# Altium schematic sheet Encoders.SchDoc
size Letter
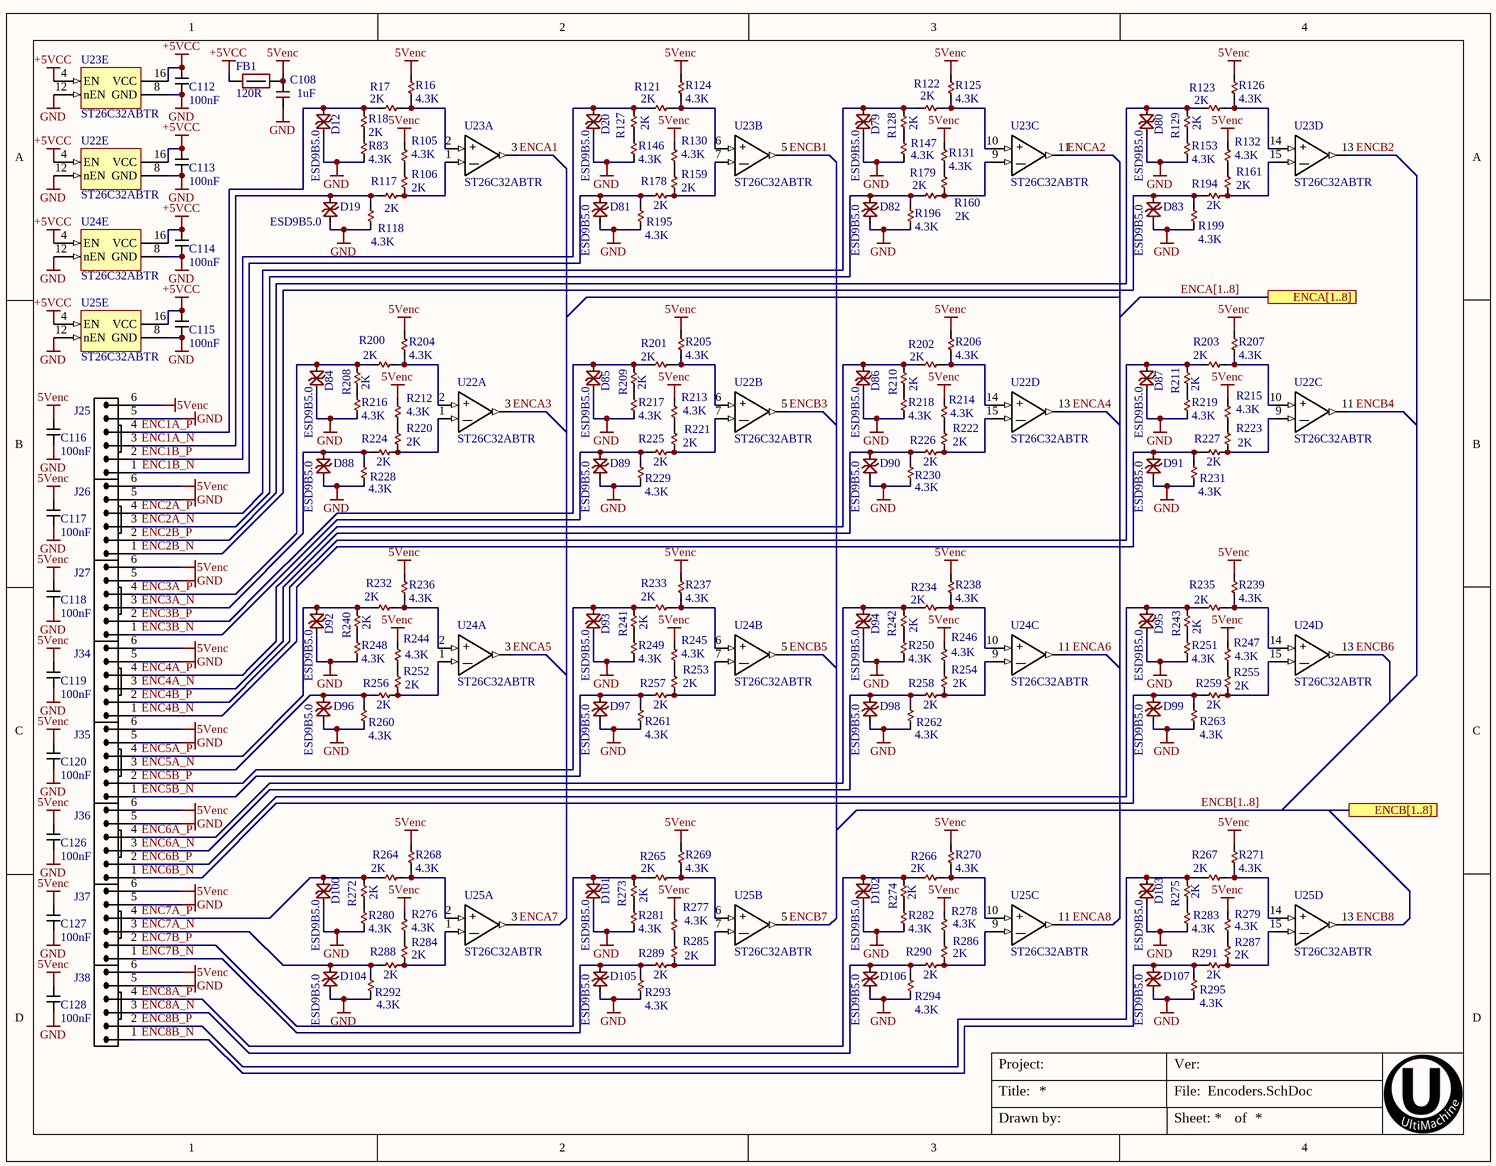
[diagram p0: Encoders.SchDoc]

## Parts
C108  1uF  [C0402]
C112  100nF  [C0201 Large Pads]
C113  100nF  [C0201 Large Pads]
C114  100nF  [C0201 Large Pads]
C115  100nF  [C0201 Large Pads]
C116  100nF  [C0201 Large Pads]
C117  100nF  [C0201 Large Pads]
C118  100nF  [C0201 Large Pads]
C119  100nF  [C0201 Large Pads]
C120  100nF  [C0201 Large Pads]
C126  100nF  [C0201 Large Pads]
C127  100nF  [C0201 Large Pads]
C128  100nF  [C0201 Large Pads]
D12  ESD9B5.0  [SOD923-D]
D19  ESD9B5.0  [SOD923-D]
D20  ESD9B5.0  [SOD923-D]
D79  ESD9B5.0  [SOD923-D]
D80  ESD9B5.0  [SOD923-D]
D81  ESD9B5.0  [SOD923-D]
D82  ESD9B5.0  [SOD923-D]
D83  ESD9B5.0  [SOD923-D]
D84  ESD9B5.0  [SOD923-D]
D85  ESD9B5.0  [SOD923-D]
D86  ESD9B5.0  [SOD923-D]
D87  ESD9B5.0  [SOD923-D]
D88  ESD9B5.0  [SOD923-D]
D89  ESD9B5.0  [SOD923-D]
D90  ESD9B5.0  [SOD923-D]
D91  ESD9B5.0  [SOD923-D]
D92  ESD9B5.0  [SOD923-D]
D93  ESD9B5.0  [SOD923-D]
D94  ESD9B5.0  [SOD923-D]
D95  ESD9B5.0  [SOD923-D]
D96  ESD9B5.0  [SOD923-D]
D97  ESD9B5.0  [SOD923-D]
D98  ESD9B5.0  [SOD923-D]
D99  ESD9B5.0  [SOD923-D]
D100  ESD9B5.0  [SOD923-D]
D101  ESD9B5.0  [SOD923-D]
D102  ESD9B5.0  [SOD923-D]
D103  ESD9B5.0  [SOD923-D]
D104  ESD9B5.0  [SOD923-D]
D105  ESD9B5.0  [SOD923-D]
D106  ESD9B5.0  [SOD923-D]
D107  ESD9B5.0  [SOD923-D]
FB1  120R  [FB0603]
J25  Molex 70543-05  [70543-05_PIN-IN-PASTE]  (value not drawn)
J26  Molex 70543-05  [70543-05_PIN-IN-PASTE]  (value not drawn)
J27  Molex 70543-05  [70543-05_PIN-IN-PASTE]  (value not drawn)
J34  Molex 70543-05  [70543-05_PIN-IN-PASTE]  (value not drawn)
J35  Molex 70543-05  [70543-05_PIN-IN-PASTE]  (value not drawn)
J36  Molex 70543-05  [70543-05_PIN-IN-PASTE]  (value not drawn)
J37  Molex 70543-05  [70543-05_PIN-IN-PASTE]  (value not drawn)
J38  Molex 70543-05  [70543-05_PIN-IN-PASTE]  (value not drawn)
R16  4.3K  [R0402]
R17  2K  [R0402]
R18  2K  [R0402]
R83  4.3K  [R0402]
R105  4.3K  [R0402]
R106  2K  [R0402]
R117  2K  [R0402]
R118  4.3K  [R0402]
R121  2K  [R0402]
R122  2K  [R0402]
R123  2K  [R0402]
R124  4.3K  [R0402]
R125  4.3K  [R0402]
R126  4.3K  [R0402]
R127  2K  [R0402]
R128  2K  [R0402]
R129  2K  [R0402]
R130  4.3K  [R0402]
R131  4.3K  [R0402]
R132  4.3K  [R0402]
R146  4.3K  [R0402]
R147  4.3K  [R0402]
R153  4.3K  [R0402]
R159  2K  [R0402]
R160  2K  [R0402]
R161  2K  [R0402]
R178  2K  [R0402]
R179  2K  [R0402]
R194  2K  [R0402]
R195  4.3K  [R0402]
R196  4.3K  [R0402]
R199  4.3K  [R0402]
R200  2K  [R0402]
R201  2K  [R0402]
R202  2K  [R0402]
R203  2K  [R0402]
R204  4.3K  [R0402]
R205  4.3K  [R0402]
R206  4.3K  [R0402]
R207  4.3K  [R0402]
R208  2K  [R0402]
R209  2K  [R0402]
R210  2K  [R0402]
R211  2K  [R0402]
R212  4.3K  [R0402]
R213  4.3K  [R0402]
R214  4.3K  [R0402]
R215  4.3K  [R0402]
R216  4.3K  [R0402]
R217  4.3K  [R0402]
R218  4.3K  [R0402]
R219  4.3K  [R0402]
R220  2K  [R0402]
R221  2K  [R0402]
R222  2K  [R0402]
R223  2K  [R0402]
R224  2K  [R0402]
R225  2K  [R0402]
R226  2K  [R0402]
R227  2K  [R0402]
R228  4.3K  [R0402]
R229  4.3K  [R0402]
R230  4.3K  [R0402]
R231  4.3K  [R0402]
R232  2K  [R0402]
R233  2K  [R0402]
R234  2K  [R0402]
R235  2K  [R0402]
R236  4.3K  [R0402]
R237  4.3K  [R0402]
R238  4.3K  [R0402]
R239  4.3K  [R0402]
R240  2K  [R0402]
R241  2K  [R0402]
R242  2K  [R0402]
R243  2K  [R0402]
R244  4.3K  [R0402]
R245  4.3K  [R0402]
R246  4.3K  [R0402]
R247  4.3K  [R0402]
R248  4.3K  [R0402]
R249  4.3K  [R0402]
R250  4.3K  [R0402]
R251  4.3K  [R0402]
R252  2K  [R0402]
R253  2K  [R0402]
R254  2K  [R0402]
R255  2K  [R0402]
R256  2K  [R0402]
R257  2K  [R0402]
R258  2K  [R0402]
R259  2K  [R0402]
R260  4.3K  [R0402]
R261  4.3K  [R0402]
R262  4.3K  [R0402]
R263  4.3K  [R0402]
R264  2K  [R0402]
R265  2K  [R0402]
R266  2K  [R0402]
R267  2K  [R0402]
R268  4.3K  [R0402]
R269  4.3K  [R0402]
R270  4.3K  [R0402]
R271  4.3K  [R0402]
R272  2K  [R0402]
R273  2K  [R0402]
R274  2K  [R0402]
R275  2K  [R0402]
R276  4.3K  [R0402]
R277  4.3K  [R0402]
R278  4.3K  [R0402]
R279  4.3K  [R0402]
R280  4.3K  [R0402]
R281  4.3K  [R0402]
R282  4.3K  [R0402]
R283  4.3K  [R0402]
R284  2K  [R0402]
R285  2K  [R0402]
R286  2K  [R0402]
R287  2K  [R0402]
R288  2K  [R0402]
R289  2K  [R0402]
R290  2K  [R0402]
R291  2K  [R0402]
R292  4.3K  [R0402]
R293  4.3K  [R0402]
R294  4.3K  [R0402]
R295  4.3K  [R0402]
U22  ST26C32ABTR  [TSSOP16-65P640X120-16N]  (parts A,B,C,D,E of 5)
U23  ST26C32ABTR  [TSSOP16-65P640X120-16N]  (parts A,B,C,D,E of 5)
U24  ST26C32ABTR  [TSSOP16-65P640X120-16N]  (parts A,B,C,D,E of 5)
U25  ST26C32ABTR  [TSSOP16-65P640X120-16N]  (parts A,B,C,D,E of 5)

## Ports
ENCA[1..8], ENCB[1..8]

## Nets
5Venc: C108.2 C116.2 C117.2 C118.2 C119.2 C120.2 C126.2 C127.2 C128.2 FB1.2 J25.6 J26.6 J27.6 J34.6 J35.6 J36.6 J37.6 J38.6 R16.2 R105.2 R124.2 R125.2 R126.2 R130.2 R131.2 R132.2 R204.2 R205.2 R206.2 R207.2 R212.2 R213.2 R214.2 R215.2 R236.2 R237.2 R238.2 R239.2 R244.2 R245.2 R246.2 R247.2 R268.2 R269.2 R270.2 R271.2 R276.2 R277.2 R278.2 R279.2
+5VCC: C112.2 C113.2 C114.2 C115.2 FB1.1 U22.4(EN) U22.16(VCC) U23.4(EN) U23.16(VCC) U24.4(EN) U24.16(VCC) U25.4(EN) U25.16(VCC)
GND: C108.1 C112.1 C113.1 C114.1 C115.1 C116.1 C117.1 C118.1 C119.1 C120.1 C126.1 C127.1 C128.1 D12.K D19.K D20.K D79.K D80.K D81.K D82.K D83.K D84.K D85.K D86.K D87.K D88.K D89.K D90.K D91.K D92.K D93.K D94.K D95.K D96.K D97.K D98.K D99.K D100.K D101.K D102.K D103.K D104.K D105.K D106.K D107.K J25.5 J26.5 J27.5 J34.5 J35.5 J36.5 J37.5 J38.5 R83.1 R118.1 R146.1 R147.1 R153.1 R195.1 R196.1 R199.1 R216.1 R217.1 R218.1 R219.1 R228.1 R229.1 R230.1 R231.1 R248.1 R249.1 R250.1 R251.1 R260.1 R261.1 R262.1 R263.1 R280.1 R281.1 R282.1 R283.1 R292.1 R293.1 R294.1 R295.1 U22.8(GND) U22.12(nEN) U23.8(GND) U23.12(nEN) U24.8(GND) U24.12(nEN) U25.8(GND) U25.12(nEN)
ENC1A_N: D19.A J25.3 R117.2 R118.2
ENC1A_P: D12.A J25.4 R17.1 R18.2
ENC1B_N: D81.A J25.1 R178.2 R195.2
ENC1B_P: D20.A J25.2 R121.1 R127.2
ENC2A_N: D82.A J26.3 R179.2 R196.2
ENC2A_P: D79.A J26.4 R122.1 R128.2
ENC2B_N: D83.A J26.1 R194.2 R199.2
ENC2B_P: D80.A J26.2 R123.1 R129.2
ENC3A_N: D88.A J27.3 R224.2 R228.2
ENC3A_P: D84.A J27.4 R200.1 R208.2
ENC3B_N: D89.A J27.1 R225.2 R229.2
ENC3B_P: D85.A J27.2 R201.1 R209.2
ENC4A_N: D90.A J34.3 R226.2 R230.2
ENC4A_P: D86.A J34.4 R202.1 R210.2
ENC4B_N: D91.A J34.1 R227.2 R231.2
ENC4B_P: D87.A J34.2 R203.1 R211.2
ENC5A_N: D96.A J35.3 R256.2 R260.2
ENC5A_P: D92.A J35.4 R232.1 R240.2
ENC5B_N: D97.A J35.1 R257.2 R261.2
ENC5B_P: D93.A J35.2 R233.1 R241.2
ENC6A_N: D98.A J36.3 R258.2 R262.2
ENC6A_P: D94.A J36.4 R234.1 R242.2
ENC6B_N: D99.A J36.1 R259.2 R263.2
ENC6B_P: D95.A J36.2 R235.1 R243.2
ENC7A_N: D104.A J37.3 R288.2 R292.2
ENC7A_P: D100.A J37.4 R264.1 R272.2
ENC7B_N: D105.A J37.1 R289.2 R293.2
ENC7B_P: D101.A J37.2 R265.1 R273.2
ENC8A_N: D106.A J38.3 R290.2 R294.2
ENC8A_P: D102.A J38.4 R266.1 R274.2
ENC8B_N: D107.A J38.1 R291.2 R295.2
ENC8B_P: D103.A J38.2 R267.1 R275.2
ENCA1: U23.3(OUT)
ENCA2: U23.11(OUT)
ENCA3: U22.3(OUT)
ENCA4: U22.13(OUT)
ENCA5: U24.3(OUT)
ENCA6: U24.11(OUT)
ENCA7: U25.3(OUT)
ENCA8: U25.11(OUT)
ENCB1: U23.5(OUT)
ENCB2: U23.13(OUT)
ENCB3: U22.5(OUT)
ENCB4: U22.11(OUT)
ENCB5: U24.5(OUT)
ENCB6: U24.13(OUT)
ENCB7: U25.5(OUT)
ENCB8: U25.13(OUT)
NetR16_1: R16.1 R17.2 U23.2(IN+)
NetR18_1: R18.1 R83.2
NetR105_1: R105.1 R106.2
NetR106_1: R106.1 R117.1 U23.1(IN-)
NetR121_2: R121.2 R124.1 U23.6(IN+)
NetR122_2: R122.2 R125.1 U23.10(IN+)
NetR123_2: R123.2 R126.1 U23.14(IN+)
NetR127_1: R127.1 R146.2
NetR128_1: R128.1 R147.2
NetR129_1: R129.1 R153.2
NetR130_1: R130.1 R159.2
NetR131_1: R131.1 R160.2
NetR132_1: R132.1 R161.2
NetR159_1: R159.1 R178.1 U23.7(IN-)
NetR160_1: R160.1 R179.1 U23.9(IN-)
NetR161_1: R161.1 R194.1 U23.15(IN-)
NetR200_2: R200.2 R204.1 U22.2(IN+)
NetR201_2: R201.2 R205.1 U22.6(IN+)
NetR202_2: R202.2 R206.1 U22.14(IN+)
NetR203_2: R203.2 R207.1 U22.10(IN+)
NetR208_1: R208.1 R216.2
NetR209_1: R209.1 R217.2
NetR210_1: R210.1 R218.2
NetR211_1: R211.1 R219.2
NetR212_1: R212.1 R220.2
NetR213_1: R213.1 R221.2
NetR214_1: R214.1 R222.2
NetR215_1: R215.1 R223.2
NetR220_1: R220.1 R224.1 U22.1(IN-)
NetR221_1: R221.1 R225.1 U22.7(IN-)
NetR222_1: R222.1 R226.1 U22.15(IN-)
NetR223_1: R223.1 R227.1 U22.9(IN-)
NetR232_2: R232.2 R236.1 U24.2(IN+)
NetR233_2: R233.2 R237.1 U24.6(IN+)
NetR234_2: R234.2 R238.1 U24.10(IN+)
NetR235_2: R235.2 R239.1 U24.14(IN+)
NetR240_1: R240.1 R248.2
NetR241_1: R241.1 R249.2
NetR242_1: R242.1 R250.2
NetR243_1: R243.1 R251.2
NetR244_1: R244.1 R252.2
NetR245_1: R245.1 R253.2
NetR246_1: R246.1 R254.2
NetR247_1: R247.1 R255.2
NetR252_1: R252.1 R256.1 U24.1(IN-)
NetR253_1: R253.1 R257.1 U24.7(IN-)
NetR254_1: R254.1 R258.1 U24.9(IN-)
NetR255_1: R255.1 R259.1 U24.15(IN-)
NetR264_2: R264.2 R268.1 U25.2(IN+)
NetR265_2: R265.2 R269.1 U25.6(IN+)
NetR266_2: R266.2 R270.1 U25.10(IN+)
NetR267_2: R267.2 R271.1 U25.14(IN+)
NetR272_1: R272.1 R280.2
NetR273_1: R273.1 R281.2
NetR274_1: R274.1 R282.2
NetR275_1: R275.1 R283.2
NetR276_1: R276.1 R284.2
NetR277_1: R277.1 R285.2
NetR278_1: R278.1 R286.2
NetR279_1: R279.1 R287.2
NetR284_1: R284.1 R288.1 U25.1(IN-)
NetR285_1: R285.1 R289.1 U25.7(IN-)
NetR286_1: R286.1 R290.1 U25.9(IN-)
NetR287_1: R287.1 R291.1 U25.15(IN-)

## Buses and harness runs
bus ENCA[1..8] = port ENCA[1..8]
bus ENCB[1..8] = port ENCB[1..8]

## Notes on the sheet
- Title:
- Project:
- File:
- Ver:
- Drawn by:
- Sheet:
- of
- (in symbol ST26C32ABTR, part A) +; _
- (in symbol ST26C32ABTR, part B) +; _
- (in symbol ST26C32ABTR, part C) +; _
- (in symbol ST26C32ABTR, part D) +; _

## Library data of the parts
C108 = 1uF 0402 6.3V X5R: CAP CER 0402 1uF 6.3V 10% X5R; MANUFACTURER: Murata; MANUFACTURER #: GRM155R60J105KE19D; PART: 1uF 6.3V X5R 0402; PART DESCRIPTION: 1µF ±10% 6.3V Ceramic Capacitor X5R 0402 (1005 Metric); DISTRIBUTOR #: 490-1320-2-ND; DISTRIBUTOR: Digikey; TOLERANCE: 10%; EE_SPEC: 6.3V; VALUE: 1uF
C112-C120 C126-C128 = 100nF 6.3V X5R 0201: CAP CER 0.1UF 6.3V 10% X5R 0201; MANUFACTURER: Samsung; MANUFACTURER #: CL03A104KQ3NNNC; VALUE: 100nF; DISTRIBUTOR: DIGI-KEY; DISTRIBUTOR #: 1276-1013-1-ND; TOLERANCE: 10%; VOLTAGE: 6.3V; PART: CL03A104KQ3NNNC
D12 D19 D20 D79-D107 = ESD9B5.0ST5G: TVS DIODE BIDIR 5VWM SOD923; MANUFACTURER: On Semi; TOLERANCE: -NA-; VALUE: 5V; EE_SPEC: 5Vso 15pF; MANUFACTURER #: ESD9B5.0ST5G; PART DESCRIPTION: TVS DIODE BIDIR 5VWM SOD923
FB1 = FERRITE 120R 3A 0603: FERRITE BEAD 120 OHM 0603 1LN; MANUFACTURER: Samsung; MANUFACTURER #: CIS10P121AC; MANUFACTURER2#: 490-5254-2-ND; VALUE: 120Rfb; TOLERANCE: -NA-; EE_SPEC: 3A; DISTRIBUTOR #: 1276-6351-2-ND; DISTRIBUTOR: Digi-Key Electronics; PART: CIS10P121AC; PART DESCRIPTION: FERRITE BEAD 120 OHM 0603 1LN
J25-J27 J34-J38 = CONN 6POS VERT 0.1" SHRD LOCKING PIP: 6 Positions Header, Shrouded Connector 0.100" (2.54mm) Through Hole Gold - Pin in Paste; MANUFACTURER #: 0705430005; PART: 6 Pin Conn VERT; TOLERANCE: -NA-; VALUE: HDR6; MANUFACTURER: Molex; PART DESCRIPTION: 6 Positions Header, Shrouded Connector 0.100" (2.54mm) Through Hole Gold; EE_SPEC: -NA-
R16 R83 R105 R118 R124-R126 R130-R132 R146 R147 R153 R195 R196 R199 R204-R207 R212-R219 R228-R231 R236-R239 R244-R251 R260-R263 R268-R271 R276-R283 R292-R295 = 4.3K 1% 0402: RES SMD 4.3K OHM 1% 1/16W 0402; MANUFACTURER: Yageo; MANUFACTURER #: RC0402FR-074K3L; PART DESCRIPTION: 2 kOhms ±1% 0.063W, 1/16W Chip Resistor 0402 (1005 Metric) Moisture Resistant Thick Film; PART: 4.3K 1% 0402; TOLERANCE: 1%; EE_SPEC: 1/16W; VALUE: 4.3K
R17 R18 R106 R117 R121-R123 R127-R129 R159-R161 R178 R179 R194 R200-R203 R208-R211 R220-R227 R232-R235 R240-R243 R252-R259 R264-R267 R272-R275 R284-R291 = 2K 1% 0402: RES SMD 2K OHM 1% 1/16W 0402; MANUFACTURER: Yageo; MANUFACTURER #: RC0402FR-072KL; PART DESCRIPTION: 2 kOhms ±1% 0.063W, 1/16W Chip Resistor 0402 (1005 Metric) Moisture Resistant Thick Film; PART: 2k 1% 0402; TOLERANCE: 1%; EE_SPEC: 1/16W; VALUE: 2K
U22-U25 = ST26C32ABTR: IC RECEIVER 0/4 16TSSOP; MANUFACTURER: STM; PART DESCRIPTION: 0/4 Receiver  RS422, RS423 16-TSSOP; Assembly Method: SMT; MANUFACTURER #: ST26C32ABTR; PART: ST26C32ABTR; VALUE: ST26C32ABTR